# EAGLE design BB_ZB-single side (EAGLE 6.4)
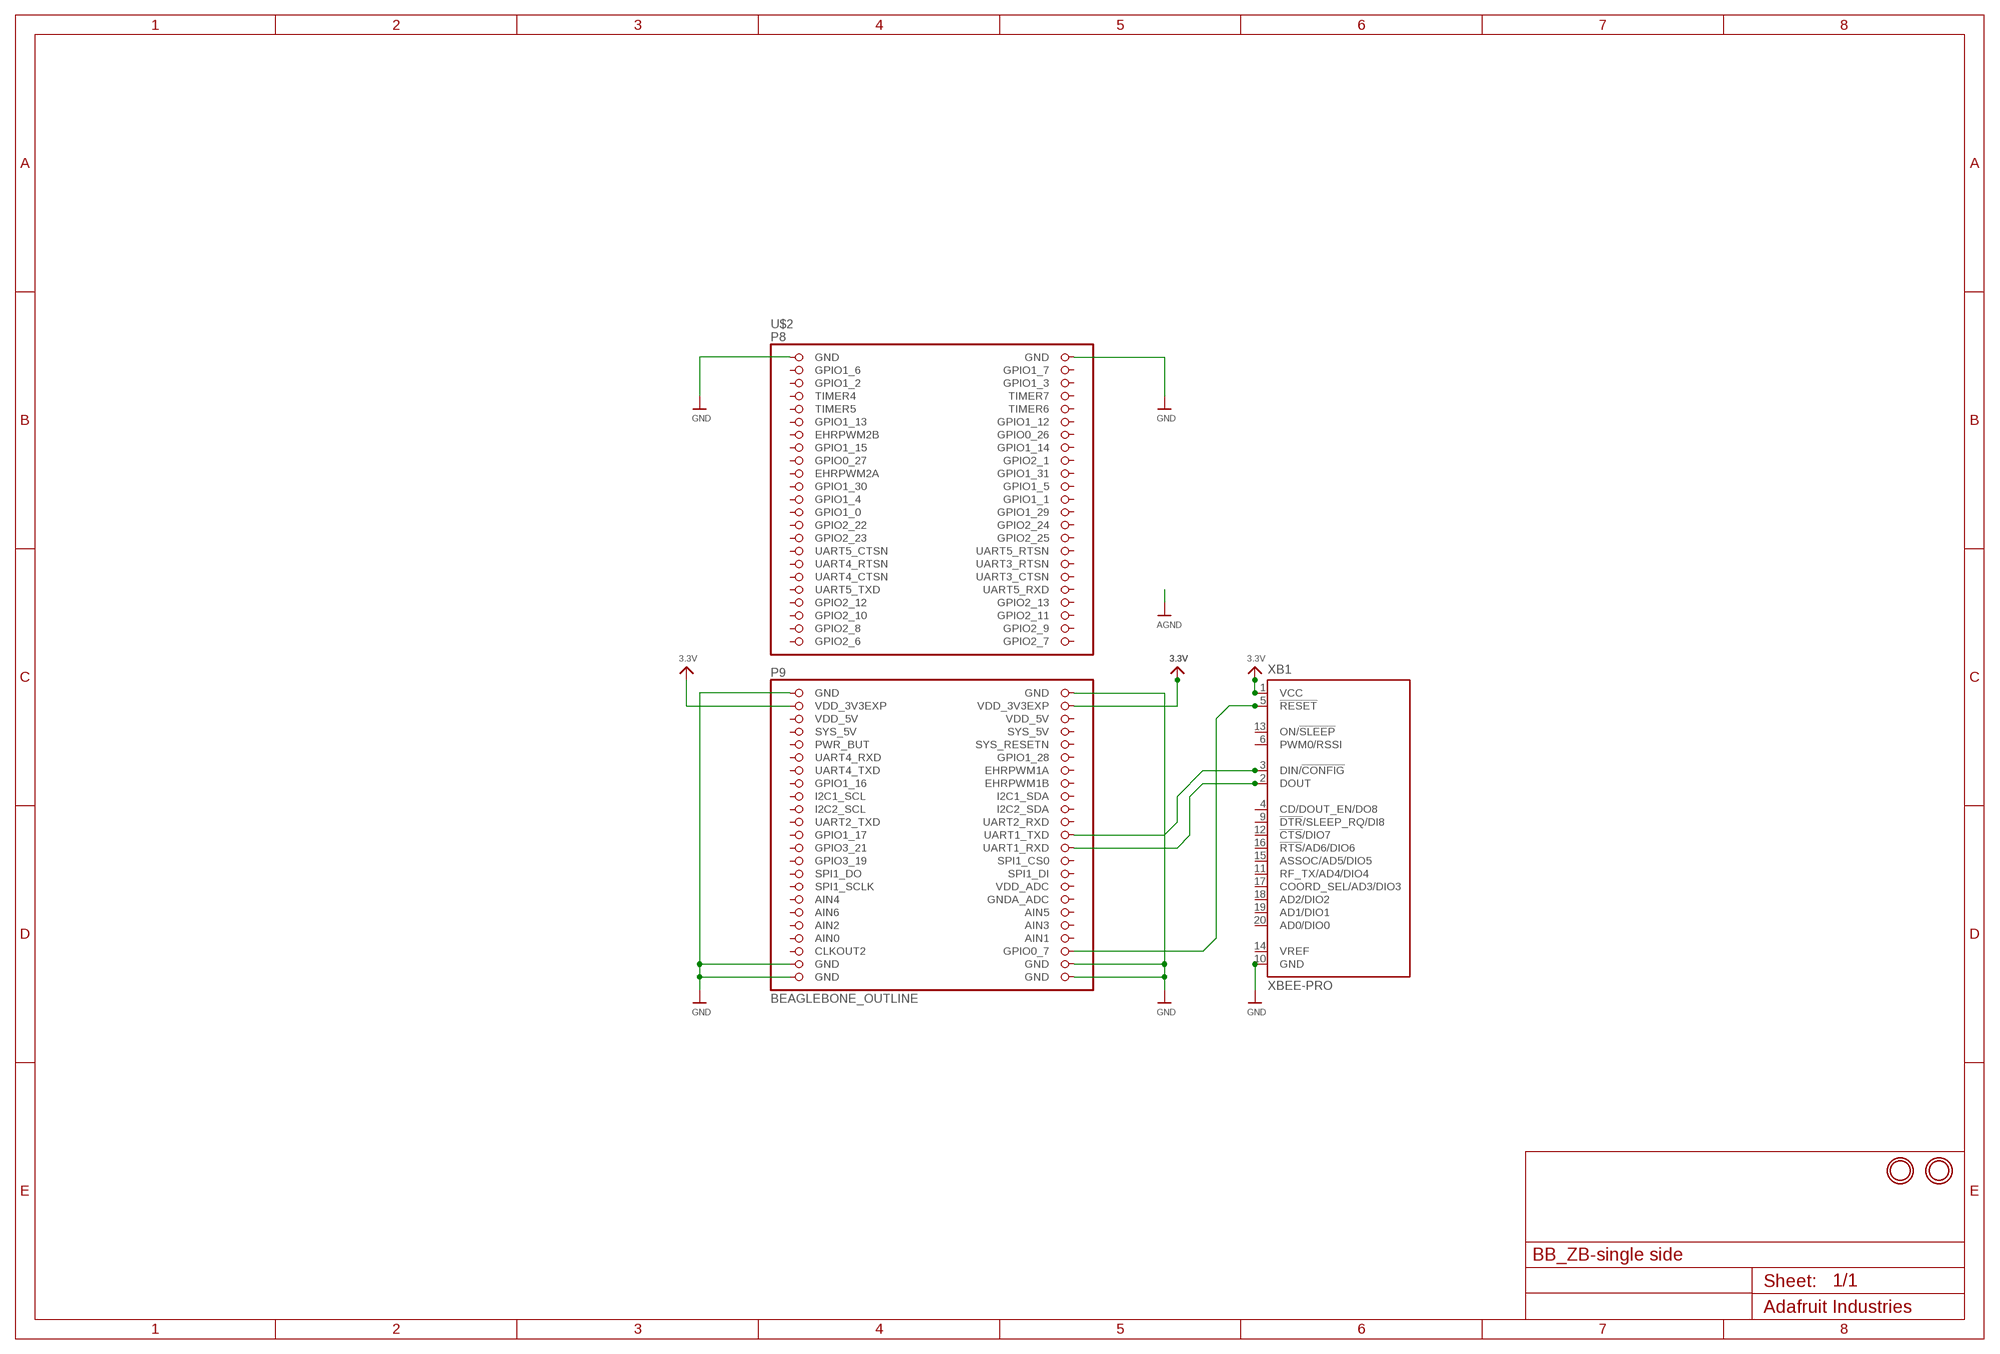
[diagram p0: schematic, sheet 1]

## Parts
U$2  BEAGLEBONE_OUTLINE  [BEAGLEBONE_SHIELD]
U$22  MOUNTINGHOLE3.0THIN  [MOUNTINGHOLE_3.0_PLATEDTHIN]
U$23  MOUNTINGHOLE3.0THIN  [MOUNTINGHOLE_3.0_PLATEDTHIN]
XB1  XBEE-PRO  [XBEE-PRO]

## Nets
3.3V: U$2.49(VDD_3V3EXP) U$2.50(VDD_3V3EXP) XB1.1(VCC)
GND: U$2.1(GND) U$2.2(GND) U$2.47(GND) U$2.48(GND) U$2.89(GND) U$2.90(GND) U$2.91(GND) U$2.92(GND) XB1.10(GND)
N$19: U$2.88(GPIO0_7) XB1.5(!RESET)
N$81: U$2.70(UART1_TXD) XB1.3(DIN/!CONFIG)
N$82: U$2.72(UART1_RXD) XB1.2(DOUT)
Unconnected: U$2.5(GPIO1_2) U$2.6(GPIO1_3) U$2.7(TIMER4) U$2.8(TIMER7) U$2.9(TIMER5) U$2.10(TIMER6) U$2.11(GPIO1_13) U$2.12(GPIO1_12) U$2.13(EHRPWM2B) U$2.14(GPIO0_26) U$2.15(GPIO1_15) U$2.16(GPIO1_14) U$2.17(GPIO0_27) U$2.18(GPIO2_1) U$2.19(EHRPWM2A) U$2.20(GPIO1_31) U$2.21(GPIO1_30) U$2.22(GPIO1_5) U$2.23(GPIO1_4) U$2.24(GPIO1_1) U$2.25(GPIO1_0) U$2.26(GPIO1_29) U$2.27(GPIO2_22) U$2.28(GPIO2_24) U$2.29(GPIO2_23) U$2.30(GPIO2_25) U$2.31(UART5_CTSN) U$2.32(UART5_RTSN) U$2.33(UART4_RTSN) U$2.34(UART3_RTSN) U$2.35(UART4_CTSN) U$2.36(UART3_CTSN) U$2.37(UART5_TXD) U$2.38(UART5_RXD) U$2.39(GPIO2_12) U$2.40(GPIO2_13) U$2.41(GPIO2_10) U$2.53(SYS_5V) U$2.54(SYS_5V) U$2.55(PWR_BUT) U$2.56(SYS_RESETN) U$2.57(UART4_RXD) U$2.58(GPIO1_28) U$2.59(UART4_TXD) U$2.60(EHRPWM1A) U$2.61(GPIO1_16) U$2.62(EHRPWM1B) U$2.63(I2C1_SCL) U$2.64(I2C1_SDA) U$2.65(I2C2_SCL) U$2.66(I2C2_SDA) U$2.67(UART2_TXD) U$2.68(UART2_RXD) U$2.69(GPIO1_17) U$2.71(GPIO3_21) U$2.73(GPIO3_19) U$2.74(SPI1_CS0) U$2.75(SPI1_DO) U$2.76(SPI1_DI) U$2.77(SPI1_SCLK) U$2.78(VDD_ADC) U$2.79(AIN4) U$2.80(GNDA_ADC) U$2.81(AIN6) U$2.82(AIN5) U$2.83(AIN2) U$2.86(AIN1) U$2.87(CLKOUT2) XB1.4(CD/DOUT_EN/DO8) XB1.6(PWM0/RSSI) XB1.9(!DTR!/SLEEP_RQ/DI8) XB1.11(RF_TX/AD4/DIO4) XB1.12(!CTS!/DIO7) XB1.13(ON/!SLEEP) XB1.14(VREF) XB1.15(ASSOC/AD5/DIO5) XB1.16(!RTS!/AD6/DIO6) XB1.17(COORD_SEL/AD3/DIO3) XB1.18(AD2/DIO2) XB1.19(AD1/DIO1) XB1.20(AD0/DIO0)

## Power pins joined to a net without a drawn wire
AIN0: U$2.85(AIN0)
AIN3: U$2.84(AIN3)
GPIO1_6: U$2.3(GPIO1_6)
GPIO1_7: U$2.4(GPIO1_7)
GPIO2_6: U$2.45(GPIO2_6)
GPIO2_7: U$2.46(GPIO2_7)
GPIO2_8: U$2.43(GPIO2_8)
GPIO2_9: U$2.44(GPIO2_9)
GPIO2_11: U$2.42(GPIO2_11)
VDD_5V: U$2.51(VDD_5V) U$2.52(VDD_5V)

## Library data of the parts
U$2 = microbuilder:BEAGLEBONE_OUTLINE
U$22 U$23 = microbuilder:MOUNTINGHOLE: Mounting Hole
XB1 = maxstream:XBEE: XBee (TM) /XBee-PRO(TM) OEM RF Modules Source: MaxStream, Inc. xbee_productmanual.pdf; MPN: XBP24-AWI-001; OC_FARNELL: 1337916; OC_NEWARK: 42M2667

## Board
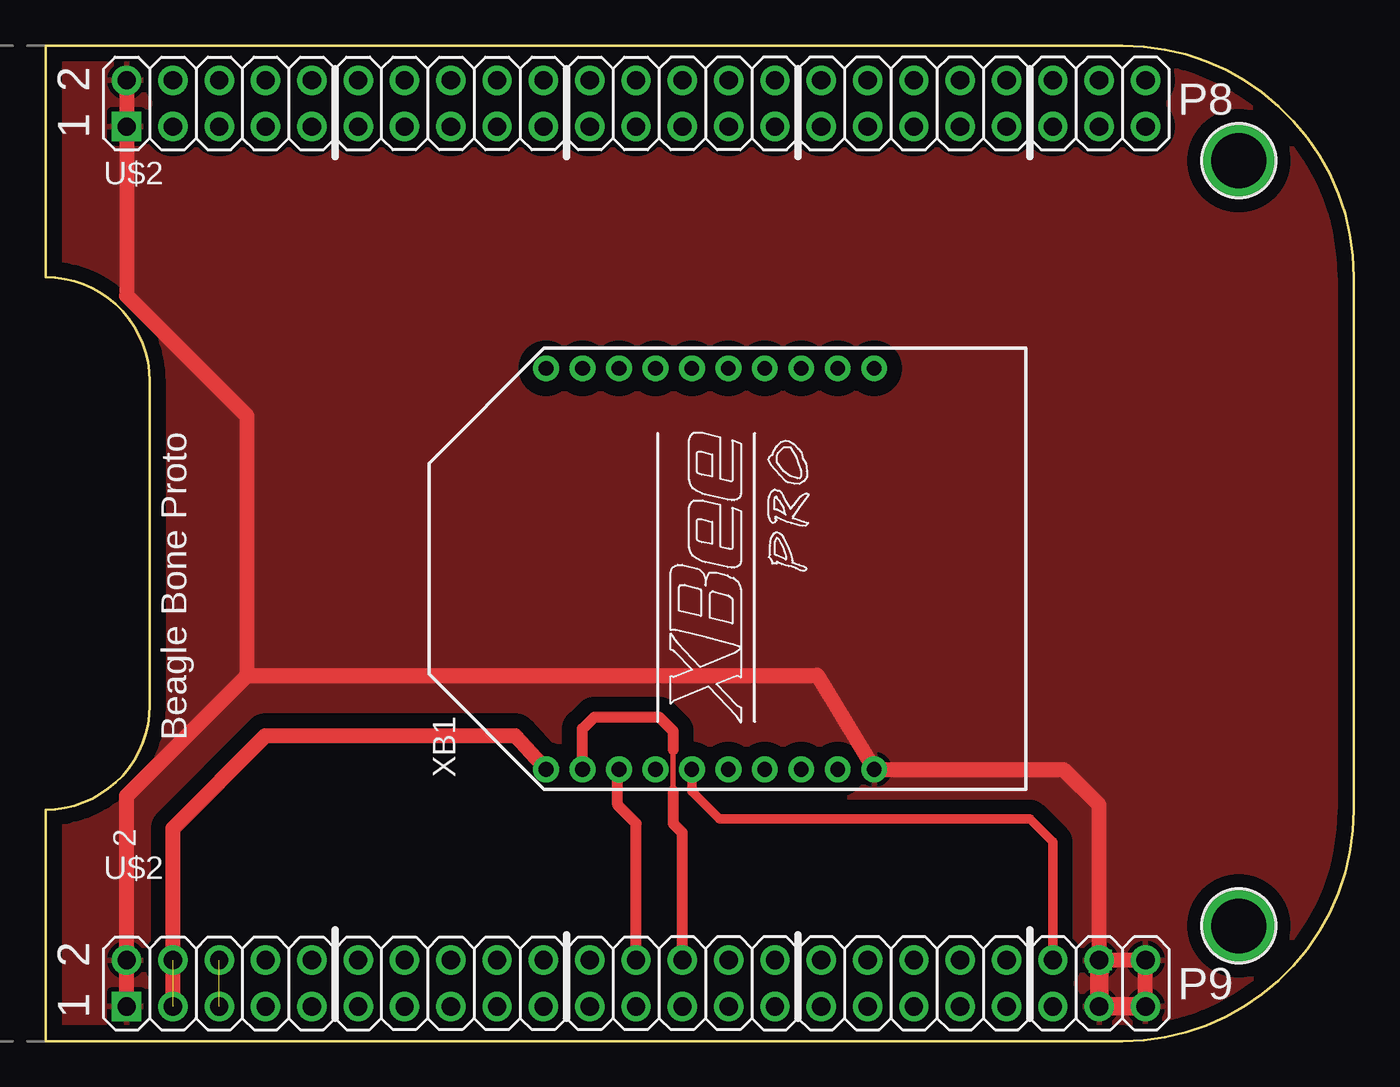
[diagram p1: board, top side]
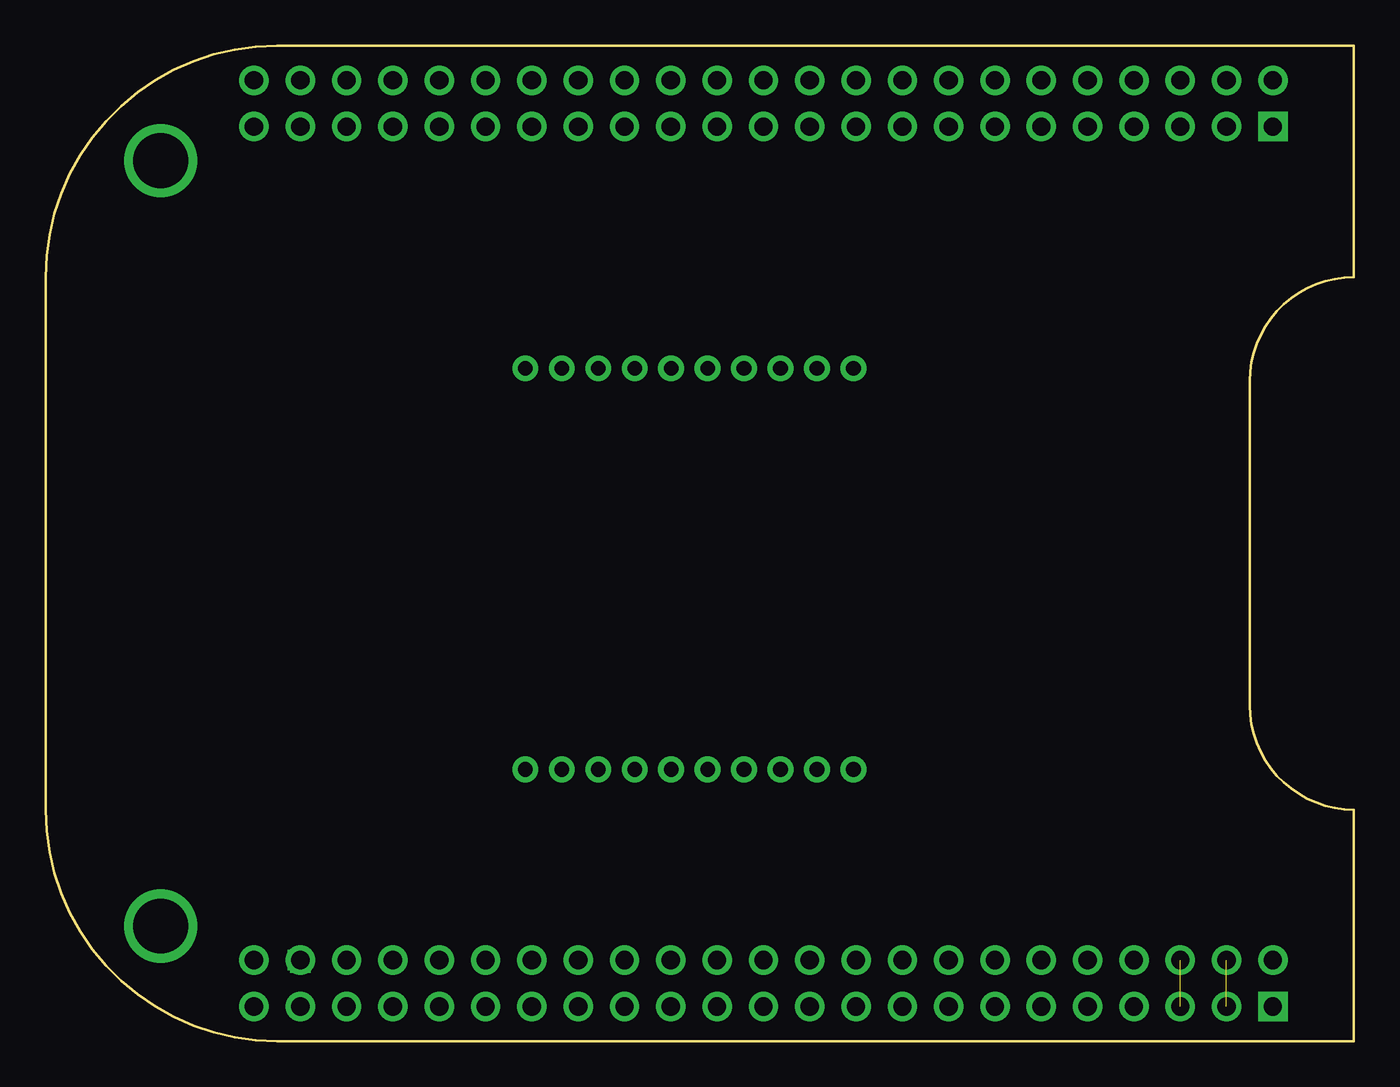
[diagram p2: board, bottom side, seen from below]

Size 71.75 x 54.61 mm. Coordinates in mm from the lower left corner, seen from the top.
Copper layers (1*16): Top 0.035mm / dielectric 1.5mm / Bottom 0.035mm
Design rules "SparkFun10mil": minimum track width 10mil, minimum drill 20mil, track to track 10mil, track to pad 10mil, pad to pad 10mil, via to via 10mil, smd to smd 10mil, copper to edge 10mil, drill to drill 10mil, minimum pad ring 12mil, minimum via ring 10mil, stop-mask expansion 4mil, vias tented up to drill 25mil, thermal gap 10mil

### Footprints (pad centres in the part's own frame; a part is rotated, then mirrored left to right if it is on the bottom)
BEAGLEBONE_SHIELD = drill 1 square: 1 4.445,19.05; 47 52.705,19.05 | drill 1: 2 1.905,19.05; 3 4.445,21.59; 4 1.905,21.59; 5 4.445,24.13; 6 1.905,24.13; 7 4.445,26.67; 8 1.905,26.67; 9 4.445,29.21; 10 1.905,29.21; 11 4.445,31.75; 12 1.905,31.75; 13 4.445,34.29; 14 1.905,34.29; 15 4.445,36.83; 16 1.905,36.83; 17 4.445,39.37; 18 1.905,39.37; 19 4.445,41.91; 20 1.905,41.91; 21 4.445,44.45; 22 1.905,44.45; 23 4.445,46.99; 24 1.905,46.99; 25 4.445,49.53; 26 1.905,49.53; 27 4.445,52.07; 28 1.905,52.07; 29 4.445,54.61; 30 1.905,54.61; 31 4.445,57.15; 32 1.905,57.15; 33 4.445,59.69; 34 1.905,59.69; 35 4.445,62.23; 36 1.905,62.23; 37 4.445,64.77; 38 1.905,64.77; 39 4.445,67.31; 40 1.905,67.31; 41 4.445,69.85; 42 1.905,69.85; 43 4.445,72.39; 44 1.905,72.39; 45 4.445,74.93; 46 1.905,74.93; 48 50.165,19.05; 49 52.705,21.59; 50 50.165,21.59; 51 52.705,24.13; 52 50.165,24.13; 53 52.705,26.67; 54 50.165,26.67; 55 52.705,29.21; 56 50.165,29.21; 57 52.705,31.75; 58 50.165,31.75; 59 52.705,34.29; 60 50.165,34.29; 61 52.705,36.83; 62 50.165,36.83; 63 52.705,39.37; 64 50.165,39.37; 65 52.705,41.91; 66 50.165,41.91; 67 52.705,44.45; 68 50.165,44.45; 69 52.705,46.99; 70 50.165,46.99; 71 52.705,49.53; 72 50.165,49.53; 73 52.705,52.07; 74 50.165,52.07; 75 52.705,54.61; 76 50.165,54.61; 77 52.705,57.15; 78 50.165,57.15; 79 52.705,59.69; 80 50.165,59.69; 81 52.705,62.23; 82 50.165,62.23; 83 52.705,64.77; 84 50.165,64.77; 85 52.705,67.31; 86 50.165,67.31; 87 52.705,69.85; 88 50.165,69.85; 89 52.705,72.39; 90 50.165,72.39; 91 52.705,74.93; 92 50.165,74.93
MOUNTINGHOLE_3.0_PLATEDTHIN = drill 3 pad 3.6: P$1 0,0
XBEE-PRO = drill 0.8 pad 1.27: 1 -11,9; 2 -11,7; 3 -11,5; 4 -11,3; 5 -11,1; 6 -11,-1; 7 -11,-3; 8 -11,-5; 9 -11,-7; 10 -11,-9; 11 11,-9; 12 11,-7; 13 11,-5; 14 11,-3; 15 11,-1; 16 11,1; 17 11,3; 18 11,5; 19 11,7; 20 11,9

### Placement (x,y rotation side)
U$2  -14.61,54.61 270 top
U$22  65.44,48.3 0 top
U$23  65.44,6.32 0 top
XB1  36.45,25.91 90 top

### Tracks (layer width: path | path; a pad name or v marks a point on that pad's centre or on a via)
3.3V  (1 unrouted)
  Top 0.813: XB1.1 25.75,16.76 12.07,16.76 6.98,11.68 U$2.49
GND  (via drill 0.6)
  Top 0.813: 11.05,20.07 4.45,13.46 U$2.47 | 11.05,20.07 11.05,34.29 4.45,40.89 U$2.2 | 11.05,20.07 42.32,20.07 XB1.10 55.83,14.91 57.78,12.95 v57.78,4.32 | U$2.91 U$2.92 | 60.2,4.45 v57.91,4.45
  Top 1.016: v57.78,4.32 U$2.89 U$2.91
  Bottom 0.813: v57.91,4.45 v57.78,4.32
  Bottom 1.016: U$2.90 v57.78,4.32
  pour Top (isolate 0.813): -0.13,41.91 -0.13,54.86 59.05,54.86 59.31,54.86 arc-90 71.75,42.42 71.75,12.7 arc-90 59.05,0 -0.13,0 -0.13,12.7 0.13,12.7 arc90 5.71,18.29 5.71,36.07 arc90
N$19
  Top 0.508: XB1.5 35.45,13.7 36.96,12.19 53.97,12.19 55.24,10.92 U$2.88
N$81
  Top 0.61: XB1.3 31.37,14.83 31.37,12.95 32.39,11.94 U$2.70
N$82
  Top 0.305: 34.42,16 34.42,13.72
  Top 0.61: 34.42,16 34.42,17.02 33.66,17.78 30.1,17.78 29.45,17.13 XB1.2 | 34.42,13.72 34.42,11.94 34.92,11.43 U$2.72
VDD_5V  (1 unrouted)

### Text on the board
tPlace: 2 | P8 | 1 | Beagle Bone Proto | 2 | 2 | P9 | 1